# EAGLE design pcb (EAGLE 9.5.1)
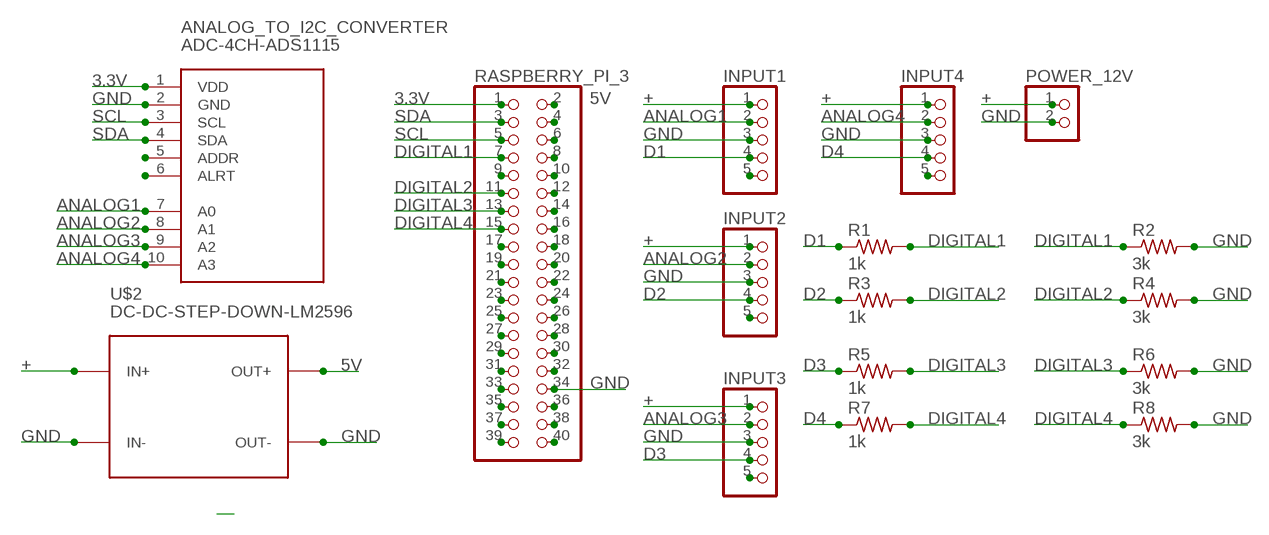
[diagram p0: schematic, sheet 1]

## Parts
ANALOG_TO_I2C_CONVERTER  ADC-4CH-ADS1115  [ADC-4CH-ADS1115]
INPUT1  PINHD-1X5  [1X05]
INPUT2  PINHD-1X5  [1X05]
INPUT3  PINHD-1X5  [1X05]
INPUT4  PINHD-1X5  [1X05]
POWER_12V  PINHD-1X2  [1X02]
R1  1k  R-US_0207/12  [0207/12]
R2  3k  R-US_0207/12  [0207/12]
R3  1k  R-US_0207/12  [0207/12]
R4  3k  R-US_0207/12  [0207/12]
R5  1k  R-US_0207/12  [0207/12]
R6  3k  R-US_0207/12  [0207/12]
R7  1k  R-US_0207/12  [0207/12]
R8  3k  R-US_0207/12  [0207/12]
RASPBERRY_PI_3  PINHD-2X20  [2X20]
U$2  DC-DC-STEP-DOWN-LM2596  [DC-DC-STEP-DOWN-LM2596]

## Nets
3.3V: ANALOG_TO_I2C_CONVERTER.1(VDD) RASPBERRY_PI_3.1
5V: RASPBERRY_PI_3.2 U$2.OUT+
+: INPUT1.1 INPUT2.1 INPUT3.1 INPUT4.1 POWER_12V.1 U$2.IN+
ANALOG1: ANALOG_TO_I2C_CONVERTER.7(A0) INPUT1.2
ANALOG2: ANALOG_TO_I2C_CONVERTER.8(A1) INPUT2.2
ANALOG3: ANALOG_TO_I2C_CONVERTER.9(A2) INPUT3.2
ANALOG4: ANALOG_TO_I2C_CONVERTER.10(A3) INPUT4.2
D1: INPUT1.4 R1.1
D2: INPUT2.4 R3.1
D3: INPUT3.4 R5.1
D4: INPUT4.4 R7.1
DIGITAL1: R1.2 R2.1 RASPBERRY_PI_3.7
DIGITAL2: R3.2 R4.1 RASPBERRY_PI_3.11
DIGITAL3: R5.2 R6.1 RASPBERRY_PI_3.13
DIGITAL4: R7.2 R8.1 RASPBERRY_PI_3.15
GND: ANALOG_TO_I2C_CONVERTER.2(GND) INPUT1.3 INPUT2.3 INPUT3.3 INPUT4.3 POWER_12V.2 R2.2 R4.2 R6.2 R8.2 RASPBERRY_PI_3.34 U$2.IN- U$2.OUT-
N$5: INPUT1.5
N$6: RASPBERRY_PI_3.9
N$10: INPUT2.5
N$11: RASPBERRY_PI_3.17
N$12: RASPBERRY_PI_3.19
N$13: RASPBERRY_PI_3.21
N$14: RASPBERRY_PI_3.23
N$15: INPUT3.5
N$16: RASPBERRY_PI_3.25
N$17: RASPBERRY_PI_3.27
N$18: RASPBERRY_PI_3.29
N$19: RASPBERRY_PI_3.31
N$20: INPUT4.5
N$22: RASPBERRY_PI_3.33
N$23: RASPBERRY_PI_3.35
N$24: RASPBERRY_PI_3.37
N$25: RASPBERRY_PI_3.39
N$26: RASPBERRY_PI_3.40
N$27: RASPBERRY_PI_3.38
N$28: RASPBERRY_PI_3.36
N$30: RASPBERRY_PI_3.32
N$31: RASPBERRY_PI_3.30
N$32: RASPBERRY_PI_3.28
N$33: RASPBERRY_PI_3.26
N$34: RASPBERRY_PI_3.24
N$35: RASPBERRY_PI_3.22
N$36: RASPBERRY_PI_3.20
N$37: RASPBERRY_PI_3.18
N$38: RASPBERRY_PI_3.16
N$39: RASPBERRY_PI_3.14
N$40: RASPBERRY_PI_3.12
N$41: RASPBERRY_PI_3.10
N$42: RASPBERRY_PI_3.8
N$43: RASPBERRY_PI_3.6
N$44: RASPBERRY_PI_3.4
N$47: ANALOG_TO_I2C_CONVERTER.5(ADDR)
N$48: ANALOG_TO_I2C_CONVERTER.6(ALRT)
SCL: ANALOG_TO_I2C_CONVERTER.3(SCL) RASPBERRY_PI_3.5
SDA: ANALOG_TO_I2C_CONVERTER.4(SDA) RASPBERRY_PI_3.3

## Library data of the parts
ANALOG_TO_I2C_CONVERTER = diy-modules:ADC-4CH-ADS1115: 4 Channel 16-Bit Analog-to-Digital Converter based on ADS1115 chip Arduino ADS1115 Getting Started Tutorial is available here: http://henrysbench.capnfatz.com/henrys-bench/arduino-voltage-measurements/arduino-ads1115-module-getting-started-tutorial/ ADS1115 datasheet is available here: http://www.ti.com/lit/ds/symlink/ads1115.pdf Click here to find device on ebay.com <http://www.ebay.com/sch/ads1115+module>
INPUT1-INPUT4 = pinhead:PINHD-1X5: PIN HEADER
POWER_12V = pinhead:PINHD-1X2: PIN HEADER
R1-R8 = rcl:R-US_: RESISTOR, American symbol; SPICEPREFIX: R
RASPBERRY_PI_3 = pinhead:PINHD-2X20: PIN HEADER
U$2 = diy-modules (3):DC-DC-STEP-DOWN-LM2596: DC/DC Step-Down Regulator based on LM2596-ADJ chip LM2596 datasheet available here: http://www.ti.com/lit/ds/symlink/lm2596.pdf Click here to find device on ebay.com <http://www.ebay.com/sch/lm2596+power+regulator>

## Net classes
0 default: width 0.5 mm, drill 0.5 mm, clearance 0.5 mm

## Board
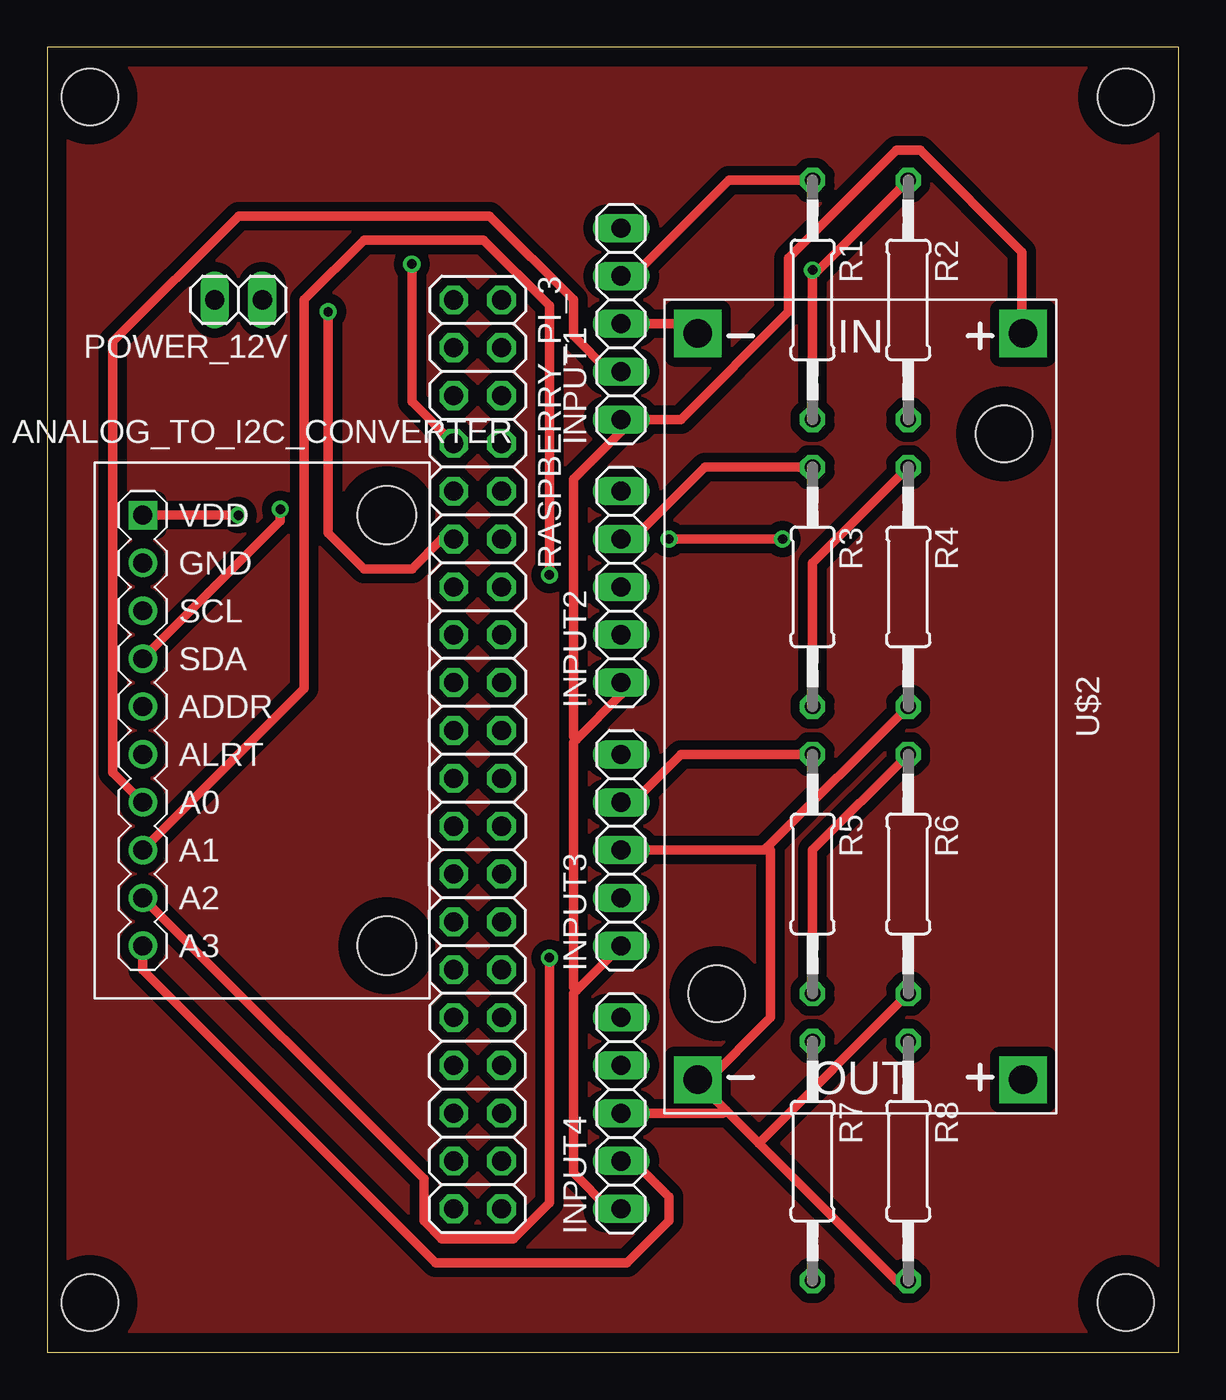
[diagram p1: board, top side]
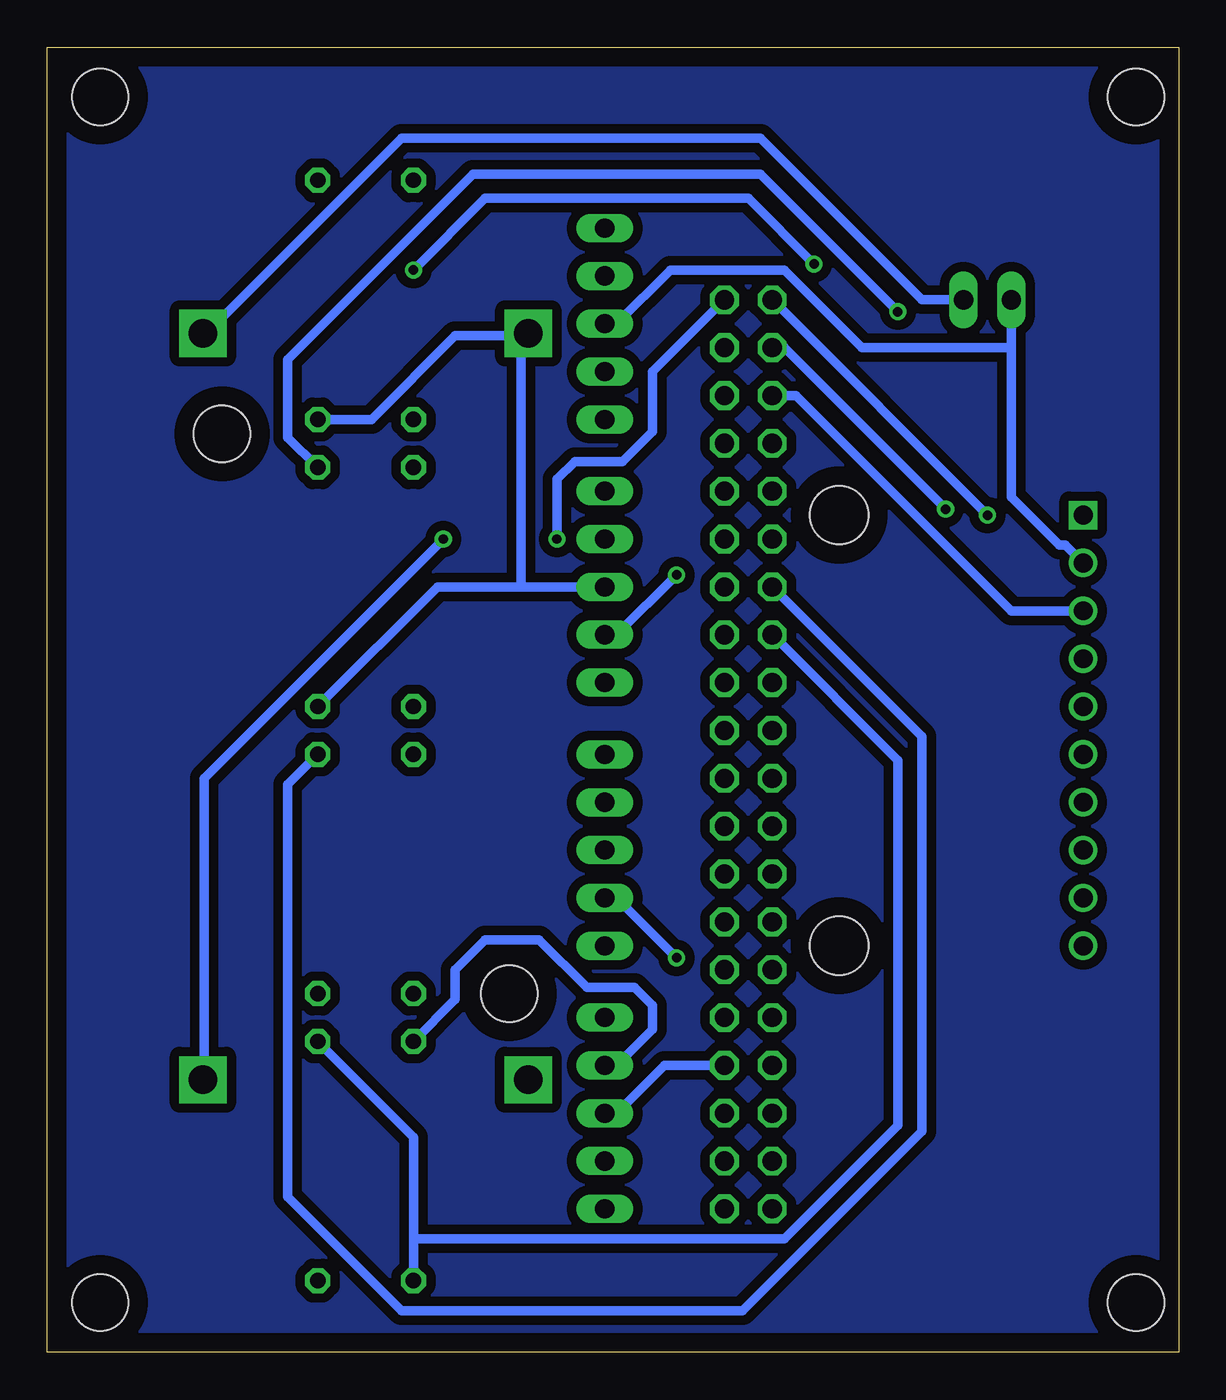
[diagram p2: board, bottom side, seen from below]

Size 60.09 x 69.3 mm. Coordinates in mm from the lower left corner, seen from the top.
Outline: 0,0 60.09,0 60.09,69.3 0,69.3 0,0
Copper layers (1*16): Top 0.035mm / dielectric 1.5mm / Bottom 0.035mm
Design rules "default": minimum track width 6mil, minimum drill 0.35mm, track to track 6mil, track to pad 6mil, pad to pad 6mil, via to via 6mil, smd to smd 6mil, copper to edge 40mil, drill to drill 6mil, minimum pad ring 10mil, minimum via ring 8mil, stop-mask expansion 4mil, vias tented up to drill 0mil, thermal gap 10mil
Holes 3 mm at 2.27,66.65 57.27,66.65 57.27,2.65 2.27,2.65
bKeepout: area 0.3,-4.6 to 1.8,-4; area 58.8,-4.6 to 60.3,-4; area 28.9,-3.9 to 31.7,-2.2; 6 lines

### Footprints (pad centres in the part's own frame; a part is rotated, then mirrored left to right if it is on the bottom)
ADC-4CH-ADS1115 = drill 1 square: 1 -6.35,11.43 | drill 1: 2 -6.35,8.89; 3 -6.35,6.35; 4 -6.35,3.81; 5 -6.35,1.27; 6 -6.35,-1.27; 7 -6.35,-3.81; 8 -6.35,-6.35; 9 -6.35,-8.89; 10 -6.35,-11.43 | hole 3.1: 6.604,11.43; 6.604,-11.43
1X05 = drill 1.016 long: 1 -5.08,0; 2 -2.54,0; 3 0,0; 4 2.54,0; 5 5.08,0
1X02 = drill 1.016 long: 1 -1.27,0; 2 1.27,0
0207/12 = drill 0.813 octagon: 1 -6.35,0; 2 6.35,0
2X20 = drill 1.016 octagon: 1 -24.13,-1.27; 2 -24.13,1.27; 3 -21.59,-1.27; 4 -21.59,1.27; 5 -19.05,-1.27; 6 -19.05,1.27; 7 -16.51,-1.27; 8 -16.51,1.27; 9 -13.97,-1.27; 10 -13.97,1.27; 11 -11.43,-1.27; 12 -11.43,1.27; 13 -8.89,-1.27; 14 -8.89,1.27; 15 -6.35,-1.27; 16 -6.35,1.27; 17 -3.81,-1.27; 18 -3.81,1.27; 19 -1.27,-1.27; 20 -1.27,1.27; 21 1.27,-1.27; 22 1.27,1.27; 23 3.81,-1.27; 24 3.81,1.27; 25 6.35,-1.27; 26 6.35,1.27; 27 8.89,-1.27; 28 8.89,1.27; 29 11.43,-1.27; 30 11.43,1.27; 31 13.97,-1.27; 32 13.97,1.27; 33 16.51,-1.27; 34 16.51,1.27; 35 19.05,-1.27; 36 19.05,1.27; 37 21.59,-1.27; 38 21.59,1.27; 39 24.13,-1.27; 40 24.13,1.27
DC-DC-STEP-DOWN-LM2596 = drill 1.5 pad 2.5 square: IN+ -19.812,8.636; IN- -19.812,-8.636; OUT+ 19.812,8.636; OUT- 19.812,-8.636 | hole 3: -14.478,7.62; 15.24,-7.62

### Placement (x,y rotation side)
ANALOG_TO_I2C_CONVERTER  11.43,33.02 0 top
INPUT1  30.48,54.61 90 top
INPUT2  30.48,40.64 90 top
INPUT3  30.48,26.67 90 top
INPUT4  30.48,12.7 90 top
POWER_12V  10.16,55.88 180 top
R1  40.64,55.88 270 top
R2  45.72,55.88 270 top
R3  40.64,40.64 270 top
R4  45.72,40.64 270 top
R5  40.64,25.4 270 top
R6  45.72,25.4 270 top
R7  40.64,10.16 270 top
R8  45.72,10.16 270 top
RASPBERRY_PI_3  22.86,31.75 270 top
U$2  43.18,34.29 270 top

### Tracks (layer width: path | path; a pad name or v marks a point on that pad's centre or on a via)
3.3V  (via drill 0.5)
  Top 0.5: v10.16,44.45 ANALOG_TO_I2C_CONVERTER.1
  Bottom 0.5: RASPBERRY_PI_3.1 v10.16,44.45
5V  (via drill 0.5)
  Top 0.5: v39.05,43.18 v33.02,43.18
  Bottom 0.5: RASPBERRY_PI_3.2 27.94,52.07 27.94,48.89 29.53,47.31 32.07,47.31 33.02,46.35 v33.02,43.18 | v39.05,43.18 51.75,30.48 51.75,14.6 U$2.OUT+
+
  Top 0.5: INPUT4.1 29.84,7.62 27.94,9.53 27.94,19.05 28.1,19.21 | INPUT3.1 28.1,19.21 | INPUT2.1 30.48,34.92 28.1,32.54 | 28.1,32.54 27.94,32.38 27.94,19.37 28.1,19.21 | 28.1,32.54 27.94,32.7 27.94,46.35 30.48,48.89 INPUT1.1 33.66,49.53 39.37,55.24 39.37,58.1 45.09,63.82 46.36,63.82 51.75,58.42 51.75,54.29 U$2.IN+
  Bottom 0.5: POWER_12V.1 13.65,55.88 22.22,64.45 41.28,64.45 51.75,53.98 U$2.IN+
ANALOG1
  Top 0.5: ANALOG_TO_I2C_CONVERTER.7 3.49,30.8 3.49,53.66 10.16,60.32 23.5,60.32 27.94,55.88 27.94,53.98 29.84,52.07 INPUT1.2
ANALOG2  (via drill 0.5)
  Top 0.5: ANALOG_TO_I2C_CONVERTER.8 13.65,35.24 13.65,55.88 16.83,59.05 23.18,59.05 26.67,55.56 v26.67,41.27
  Bottom 0.5: v26.67,41.27 29.84,38.1 INPUT2.2
ANALOG3  (via drill 0.5)
  Top 0.5: ANALOG_TO_I2C_CONVERTER.9 20,9.21 20,6.99 20.95,6.03 24.77,6.03 26.67,7.94 v26.67,20.95
  Bottom 0.5: v26.67,20.95 29.84,24.13 INPUT3.2
ANALOG4
  Top 0.5: ANALOG_TO_I2C_CONVERTER.10 5.08,20.32 20.64,4.76 30.8,4.76 33.02,6.99 33.02,8.26 31.11,10.16 INPUT4.2
D1
  Top 0.5: R1.1 36.2,62.23 31.11,57.15 INPUT1.4
D2
  Top 0.5: R3.1 34.93,46.99 31.11,43.18 INPUT2.4
D3
  Top 0.5: R5.1 33.66,31.75 31.11,29.21 INPUT3.4
D4
  Bottom 0.5: R7.1 38.42,18.73 38.42,20.32 36.83,21.91 33.97,21.91 31.43,19.37 28.89,19.37 27.94,18.41 27.94,17.15 29.84,15.24 INPUT4.4
DIGITAL1  (via drill 0.5)
  Top 0.5: R1.2 40.64,57.15 40.8,57.31 | R2.1 40.8,57.31 | RASPBERRY_PI_3.7 19.37,50.48 v19.37,57.79 | v40.64,57.47 40.8,57.31
  Bottom 0.5: v19.37,57.79 22.86,61.28 36.83,61.28 v40.64,57.47
DIGITAL2  (via drill 0.5)
  Top 0.5: R3.2 40.64,41.91 R4.1 | RASPBERRY_PI_3.11 20.95,43.18 19.37,41.59 16.83,41.59 14.92,43.5 v14.92,55.24
  Bottom 0.5: v14.92,55.24 22.22,62.55 37.47,62.55 47.31,52.7 47.31,48.58 R4.1
DIGITAL3
  Top 0.5: R5.2 40.64,26.67 R6.1
  Bottom 0.5: RASPBERRY_PI_3.13 13.65,32.7 13.65,11.75 23.18,2.22 41.28,2.22 47.31,8.26 47.31,30.16 R6.1
DIGITAL4
  Bottom 0.5: 40.64,6.03 40.64,11.43 R8.1 | 40.64,6.03 R7.2 | RASPBERRY_PI_3.15 14.92,31.43 14.92,12.06 20.95,6.03 40.64,6.03
GND
  Top 0.5: R8.2 45.09,3.81 37.78,11.11 | 36.04,12.86 34.61,14.29 U$2.OUT- 34.93,14.29 38.42,17.78 38.42,26.67 38.26,26.83 | 36.04,12.86 37.78,11.11 | 37.78,11.11 R6.2 | INPUT4.3 35.88,12.7 36.04,12.86 | 38.26,26.83 38.1,26.67 INPUT3.3 | 38.26,26.83 R4.2 | INPUT1.3 33.97,54.61 34.29,54.29 U$2.IN-
  Bottom 0.5: RASPBERRY_PI_3.34 27.3,15.24 29.84,12.7 INPUT4.3 | 34.93,40.64 39.37,40.64 R4.2 | 34.93,40.64 INPUT2.3 | ANALOG_TO_I2C_CONVERTER.2 6.03,42.86 6.35,42.86 8.89,45.4 8.89,53.34 | POWER_12V.2 8.89,53.34 | R2.2 42.86,49.53 38.42,53.98 34.93,53.98 | 34.93,53.98 34.61,53.98 U$2.IN- 34.93,53.98 | 8.89,53.34 16.83,53.34 20.95,57.47 26.99,57.47 29.84,54.61 INPUT1.3 | 34.93,53.98 34.93,40.64
SCL
  Bottom 0.5: ANALOG_TO_I2C_CONVERTER.3 8.89,39.37 20.32,50.8 RASPBERRY_PI_3.5
SDA  (via drill 0.5)
  Top 0.5: ANALOG_TO_I2C_CONVERTER.4 12.38,44.13 v12.38,44.77
  Bottom 0.5: v12.38,44.77 20.95,53.34 RASPBERRY_PI_3.3
SISI
  pour Bottom: 0,69.31 0,0 60.42,0 60.42,69.31
SOSO
  pour Top: 0,69.31 0,0 60.42,0 60.42,69.31